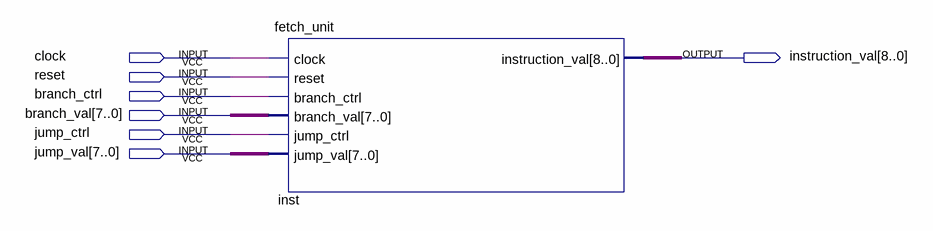
[diagram p0: schematic sheet]
// Quartus schematic fetch_unit_bench_diagram.bdf as structural Verilog: 1 symbols, 7 pins
module fetch_unit_bench_diagram (
  input  clock,
  input  reset,
  input  branch_ctrl,
  input  [7:0] branch_val,
  input  jump_ctrl,
  input  [7:0] jump_val,
  output [8:0] instruction_val
);

  fetch_unit inst (
    .clock(clock), .reset(reset), .branch_ctrl(branch_ctrl), .branch_val(branch_val), .jump_ctrl(jump_ctrl),
    .jump_val(jump_val), .instruction_val(instruction_val));
endmodule
